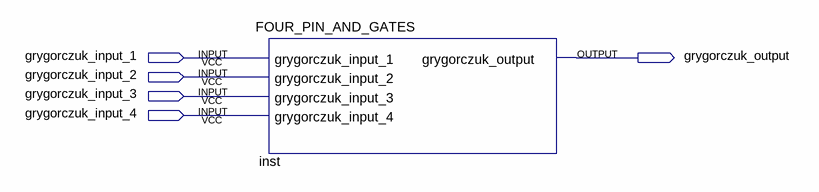
[diagram p0: schematic sheet]
// Quartus schematic FOUR_PIN_AND_SYMBOL.bdf as structural Verilog: 1 symbols, 5 pins
module FOUR_PIN_AND_SYMBOL (
  input  grygorczuk_input_1,
  input  grygorczuk_input_2,
  input  grygorczuk_input_3,
  input  grygorczuk_input_4,
  output grygorczuk_output
);

  FOUR_PIN_AND_GATES inst (
    .grygorczuk_input_1(grygorczuk_input_1), .grygorczuk_input_2(grygorczuk_input_2),
    .grygorczuk_input_3(grygorczuk_input_3), .grygorczuk_input_4(grygorczuk_input_4),
    .grygorczuk_output(grygorczuk_output));
endmodule
